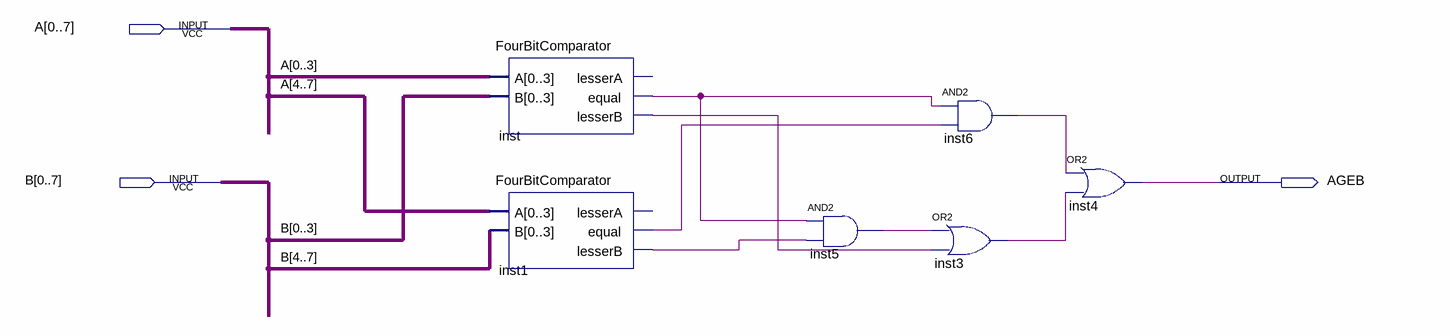
[diagram p0: schematic sheet]
// Quartus schematic EightBitComparator.bdf as structural Verilog: 6 symbols, 3 pins
module EightBitComparator (
  input  [0:7] A,
  input  [0:7] B,
  output AGEB
);

  wire inst1_equal, inst1_lesserb, inst3_out, inst5_out, inst6_out, inst_equal, inst_lesserb;

  FourBitComparator inst (.A(A[0:3]), .B(B[0:3]), .equal(inst_equal), .lesserB(inst_lesserb));  // open: lesserA
  FourBitComparator inst1 (.A(A[4:7]), .B(B[4:7]), .equal(inst1_equal), .lesserB(inst1_lesserb));  // open: lesserA
  and inst5 (inst5_out, inst_equal, inst1_lesserb);
  and inst6 (inst6_out, inst_equal, inst1_equal);
  or inst3 (inst3_out, inst5_out, inst_lesserb);
  or inst4 (AGEB, inst6_out, inst3_out);
endmodule
